# EAGLE schematic v1 (EAGLE 9.6.2)
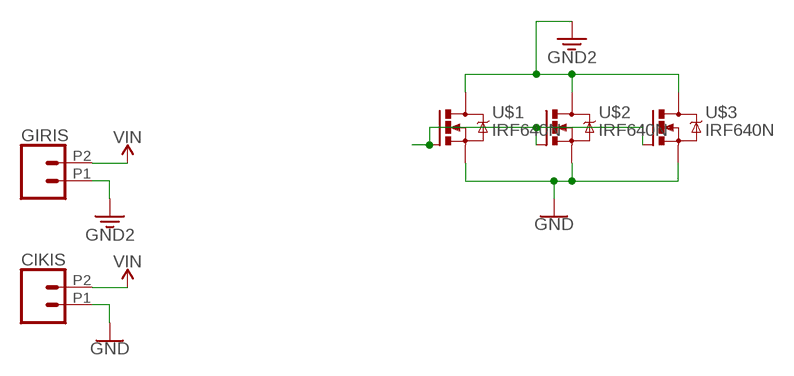
[diagram p0: schematic, sheet 1]

## Parts
CIKIS  CONN_022.54MM_SCREWTERM  [1X02_2.54_SCREWTERM]
GIRIS  CONN_022.54MM_SCREWTERM  [1X02_2.54_SCREWTERM]
U$1  IRF640N  [TO-220-PAD]
U$2  IRF640N  [TO-220-PAD]
U$3  IRF640N  [TO-220-PAD]

## Nets
3.3V: GIRIS.P1 U$1.TAB(D) U$2.TAB(D) U$3.TAB(D) ; supply symbol labelled GND2
GND: CIKIS.P1 U$1.3(S) U$2.3(S) U$3.3(S)
N$1: U$1.1(G) U$2.1(G) U$3.1(G)
VIN: CIKIS.P2 GIRIS.P2

## Library data of the parts
CIKIS GIRIS = SparkFun-Connectors:CONN_02: Multi connection point. Often used as Generic Header-pin footprint for 0.1 inch spaced/style header connections On any of the 0.1 inch spaced packages, you can populate with these: Break Away Headers - Straight <https://www.sparkfun.com/products/116> (PRT-00116) Break Away Male Headers - Right Angle <https://www.sparkfun.com/products/553> (PRT-00553) Female Headers <https://www.sparkfun.com/products/115> (PRT-00115) Break Away Headers - Machine Pin <https://www.sparkfun.com/products/117> (PRT-00117) Break Away Female Headers - Swiss Machine Pin <https://www.sparkfun.com/products/743> (PRT-00743) For SCREWTERMINALS and SPRING TERMINALS visit here: Screw Terimnals on SparkFun.com <https://www.sparkfun.com/search/results?term=Screw+Terminals> (5mm/3.5mm/2.54mm spacing) This device is also useful as a general connection point to wire up your design to another part of your project. Our various solder wires solder well into these plated through hole pads. Hook-Up Wire - Assortment (Stranded, 22 AWG) <https://www.sparkfun.com/products/11375> (PRT-11375) Hook-Up Wire - Assortment (Solid Core, 22 AWG) <https://www.sparkfun.com/products/11367> (PRT-11367) View the entire wire category on our website here <https://www.sparkfun.com/categories/141> Special notes: Molex polarized connector foot print use with: PRT-08233 with associated crimp pins and housings. 2.54_SCREWTERM for use with PRT-10571. 3.5mm Screw Terminal footprints for PRT-08084 5mm Screw Terminal footprints for use with PRT-08432
U$1-U$3 = El_yapimi:IRF640N